# EAGLE board mainBoard (EAGLE 7.1.0)
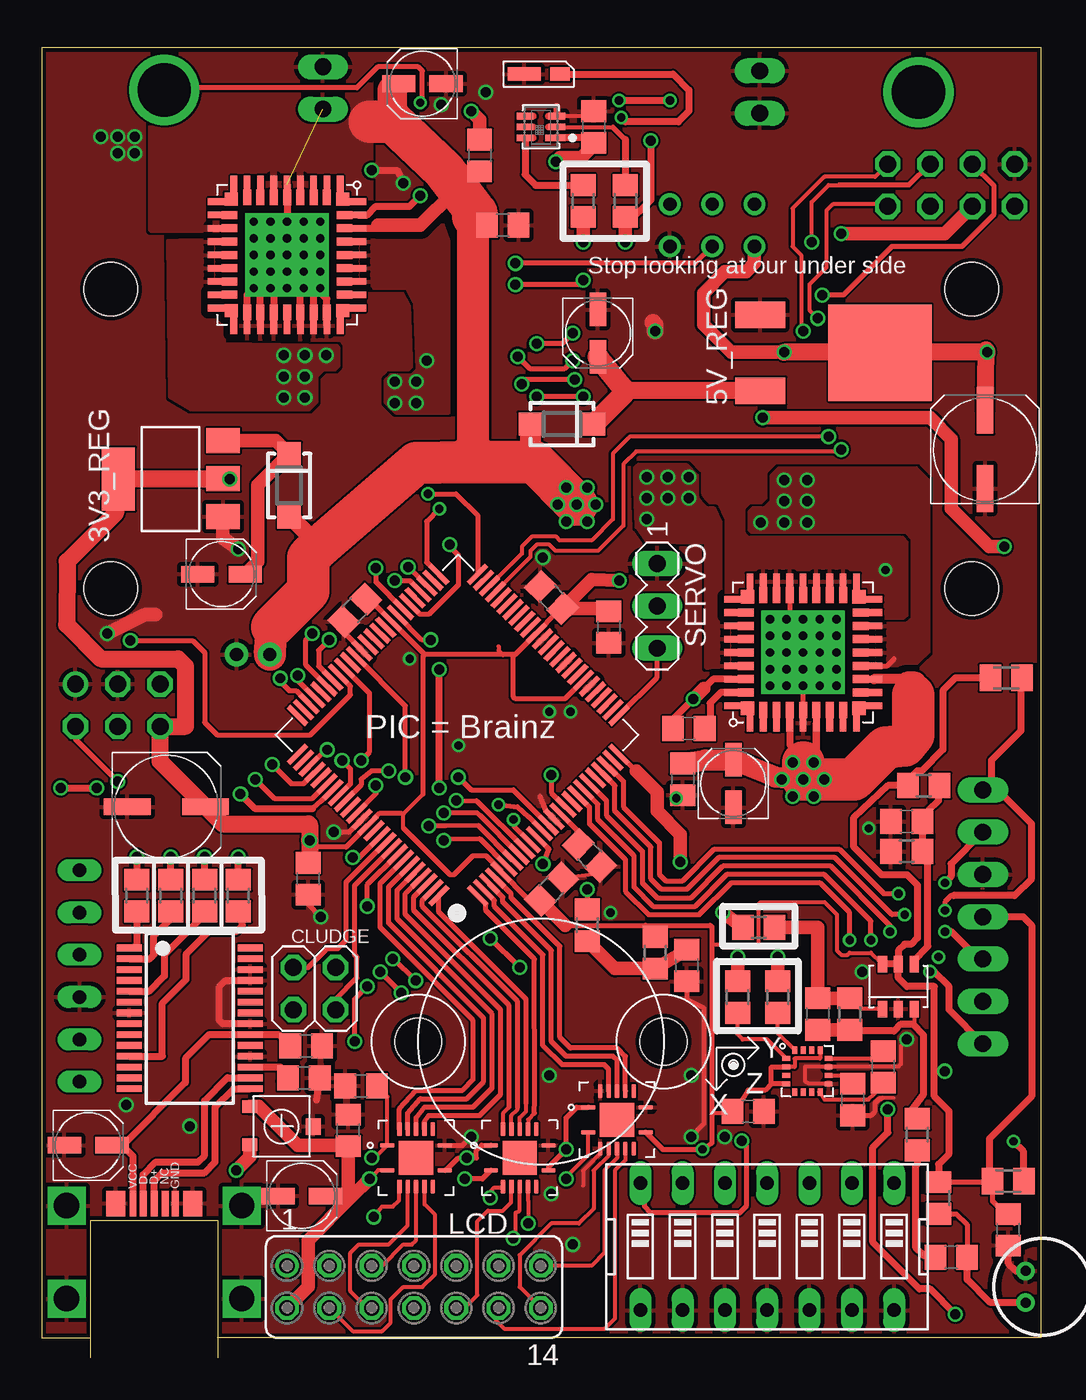
[diagram p8: board, top side]
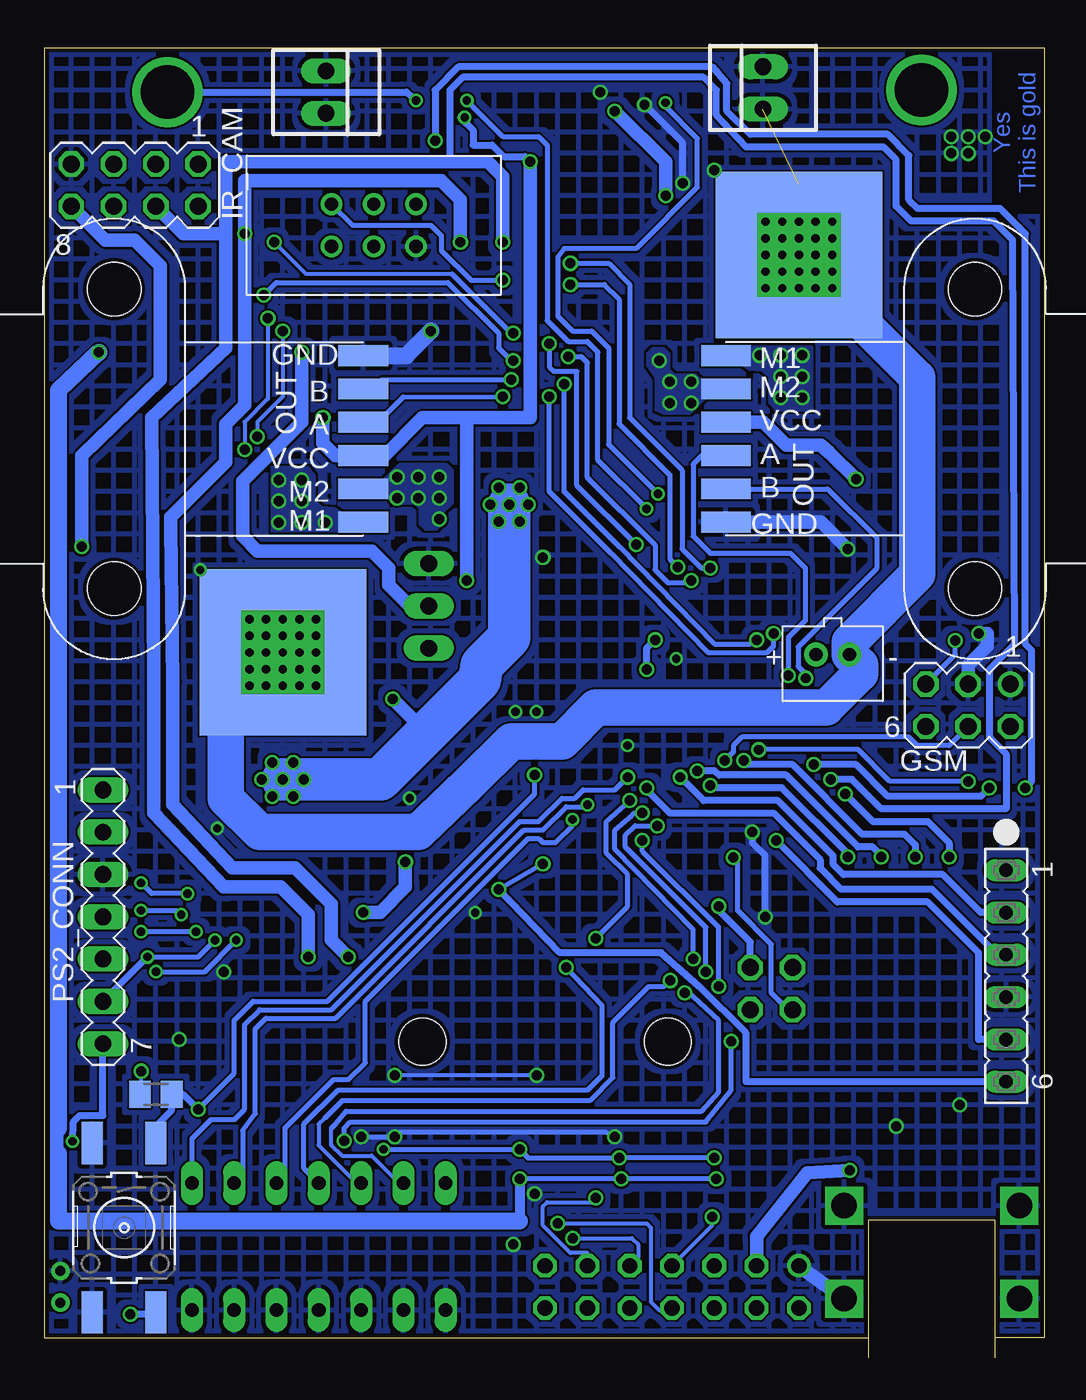
[diagram p9: board, bottom side, seen from below]

Size 60.01 x 78.69 mm. Coordinates in mm from the lower left corner, seen from the top.
Outline: 2.92,1.22 0,1.22 0,78.69 60.01,78.69 60.01,1.22 10.54,1.22
Copper layers (1*16): Top 0.035mm / dielectric 1.5mm / Bottom 0.035mm
Design rules "dirt_cheap_dirty_boards.v1": minimum track width 5mil, minimum drill 12mil, track to track 5mil, track to pad 5mil, pad to pad 5mil, via to via 5mil, smd to smd 0mil, copper to edge 10mil, drill to drill 10mil, minimum pad ring 10mil, minimum via ring 6mil, stop-mask expansion 2mil, vias tented up to drill 25mil, thermal gap 10mil

## Footprints (pad centres in the part's own frame; a part is rotated, then mirrored left to right if it is on the bottom)
SOT223 = smd 1.499 x 2.007: 1 -2.261,-3.15; 2 0.025,-3.15; 3 2.311,-3.15 | smd 3.81 x 2.007: 4 0,3.15
DPAK-2 = smd 3 x 1.6: 1 -1.5,0.8; 3 -1.5,5.37 | smd 6.2 x 5.8: 2 -8.68,3.085
UD-4X5,8_NICHICON = smd 2 x 1: + 1.425,0; - -1.425,0
JST-PH-2-THM = drill 0.8 pad 1.422: 1 1,0; 2 -1,0
UD-6,3X5,8_NICHICON = smd 2.8 x 1: + 2.35,0; - -2.35,0
C0805 = smd 1.3 x 1.5: 1 -0.95,0; 2 0.95,0
2X02 = drill 1.016 octagon: 1 -1.27,-1.27; 2 -1.27,1.27; 3 1.27,-1.27; 4 1.27,1.27
SOD123 = smd 1.4 x 1.4: A 1.9,0; C -1.9,0
MA03-2 = drill 1.016: 1 -2.54,-1.27 | drill 1.016 octagon: 2 -2.54,1.27; 3 0,-1.27; 4 0,1.27; 5 2.54,-1.27; 6 2.54,1.27
SSOP28 = smd 0.4 x 1.5: 1 -4.225,-3.625; 2 -3.575,-3.625; 3 -2.925,-3.625; 4 -2.275,-3.625; 5 -1.625,-3.625; 6 -0.975,-3.625; 7 -0.325,-3.625; 8 0.325,-3.625; 9 0.975,-3.625; 10 1.625,-3.625; 11 2.275,-3.625; 12 2.925,-3.625; 13 3.575,-3.625; 14 4.225,-3.625; 15 4.225,3.625; 16 3.575,3.625; 17 2.925,3.625; 18 2.275,3.625; 19 1.625,3.625; 20 0.975,3.625; 21 0.325,3.625; 22 -0.325,3.625; 23 -0.975,3.625; 24 -1.625,3.625; 25 -2.275,3.625; 26 -2.925,3.625; 27 -3.575,3.625; 28 -4.225,3.625
MA04-2 = drill 1.016 octagon: 1 -3.81,-1.27; 2 -3.81,1.27; 3 -1.27,-1.27; 4 -1.27,1.27; 5 1.27,-1.27; 6 1.27,1.27; 7 3.81,-1.27; 8 3.81,1.27
FE07-2 = drill 0.914: 1 -7.62,1.27 | drill 0.914 octagon: 2 -7.62,-1.27; 3 -5.08,1.27; 4 -5.08,-1.27; 5 -2.54,1.27; 6 -2.54,-1.27; 7 0,1.27; 8 0,-1.27; 9 2.54,1.27; 10 2.54,-1.27; 11 5.08,1.27; 12 5.08,-1.27; 13 7.62,1.27; 14 7.62,-1.27
WM-63PR = drill 0.6 pad 1: 1 -1,0.95; 2 -1,-0.95
MA07-1 = drill 1.016 long: 1 -7.62,0; 2 -5.08,0; 3 -2.54,0; 4 0,0; 5 2.54,0; 6 5.08,0; 7 7.62,0
R0805 = smd 1.3 x 1.5: 1 -0.95,0; 2 0.95,0
M0805 = smd 1.3 x 1.6: 1 -0.95,0; 2 0.95,0
B3F-10XX = smd 2.54 x 1.27: 1 -5.08,1.905; 2 5.08,1.905; 3 -5.08,-1.905; 4 5.08,-1.905
MA03-1 = drill 1.016 long: 1 -2.54,0; 2 0,0; 3 2.54,0
FE06 = drill 0.813 long: 1 -6.35,0; 2 -3.81,0; 3 -1.27,0; 4 1.27,0; 5 3.81,0; 6 6.35,0
EDG-07 = drill 0.813 long: 1 -7.62,-3.81; 2 -5.08,-3.81; 3 -2.54,-3.81; 4 0,-3.81; 5 2.54,-3.81; 6 5.08,-3.81; 7 7.62,-3.81; 8 7.62,3.81; 9 5.08,3.81; 10 2.54,3.81; 11 0,3.81; 12 -2.54,3.81; 13 -5.08,3.81; 14 -7.62,3.81
TCS3472_FN6 = smd 1.2 x 0.4: P$1 -0.85,0.65 | smd 1 x 0.4: P$2 -0.95,0; P$3 -0.95,-0.65; P$4 0.95,-0.65; P$5 0.95,0; P$6 0.95,0.65
QTFP-100 = smd 1.524 x 0.305: P1 -0.1,13.55; P2 -0.1,13.05; P3 -0.1,12.55; P4 -0.1,12.05; P5 -0.1,11.55; P6 -0.1,11.05; P7 -0.1,10.55; P8 -0.1,10.05; P9 -0.1,9.55; P10 -0.1,9.05; P11 -0.1,8.55; P12 -0.1,8.05; P13 -0.1,7.55; P14 -0.1,7.05; P15 -0.1,6.55; P16 -0.1,6.05; P17 -0.1,5.55; P18 -0.1,5.05; P19 -0.1,4.55; P20 -0.1,4.05; P21 -0.1,3.55; P22 -0.1,3.05; P23 -0.1,2.55; P24 -0.1,2.05; P25 -0.1,1.549; P51 15.2,1.549; P52 15.2,2.05; P53 15.2,2.55; P54 15.2,3.05; P55 15.2,3.55; P56 15.2,4.05; P57 15.2,4.55; P58 15.2,5.05; P59 15.2,5.55; P60 15.2,6.05; P61 15.2,6.55; P62 15.2,7.05; P63 15.2,7.55; P64 15.2,8.05; P65 15.2,8.55; P66 15.2,9.05; P67 15.2,9.55; P68 15.2,10.05; P69 15.2,10.55; P70 15.2,11.05; P71 15.2,11.55; P72 15.2,12.05; P73 15.2,12.55; P74 15.2,13.05; P75 15.2,13.55 | smd 0.305 x 1.524: P26 1.549,-0.1; P27 2.05,-0.1; P28 2.55,-0.1; P29 3.05,-0.1; P30 3.55,-0.1; P31 4.05,-0.1; P32 4.55,-0.1; P33 5.05,-0.1; P34 5.55,-0.1; P35 6.05,-0.1; P36 6.55,-0.1; P38 7.55,-0.1; P39 8.05,-0.1; P40 8.55,-0.1; P41 9.05,-0.1; P42 9.55,-0.1; P43 10.05,-0.1; P44 10.55,-0.1; P45 11.05,-0.1; P46 11.55,-0.1; P47 12.05,-0.1; P48 12.55,-0.1; P49 13.05,-0.1; P50 13.55,-0.1; P76 13.55,15.2; P77 13.05,15.2; P78 12.55,15.2; P79 12.05,15.2; P80 11.55,15.2; P81 11.05,15.2; P82 10.55,15.2; P83 10.05,15.2; P84 9.55,15.2; P85 9.05,15.2; P86 8.55,15.2; P87 8.05,15.2; P88 7.55,15.2; P89 7.05,15.2; P90 6.55,15.2; P91 6.05,15.2; P92 5.55,15.2; P93 5.05,15.2; P94 4.55,15.2; P95 4.05,15.2; P96 3.55,15.2; P97 3.05,15.2; P98 2.55,15.2; P99 2.05,15.2; P100 1.549,15.2; P337 7.05,-0.1
MICRO_USB_FCI = smd 0.406 x 1.524: D+ 0,2.921; D- -0.66,2.921; GND 1.27,2.921; ID 0.66,2.921; VCC -1.27,2.921 | smd 1.143 x 1.524: GND1 -2.311,2.921; GND2 2.311,2.921 | drill 1.524 square: P$1 -5.258,2.794; P$2 -5.258,-2.794; P$3 5.258,-2.794; P$4 5.258,2.794
HMC5883L = smd 0.457 x 0.305: P$1 -1.27,0.762; P$2 -1.27,0.254; P$3 -1.27,-0.254; P$4 -1.27,-0.762; P$9 1.27,-0.762; P$10 1.27,-0.254; P$11 1.27,0.254; P$12 1.27,0.762 | smd 0.305 x 0.457: P$5 -0.762,-1.27; P$6 -0.254,-1.27; P$7 0.254,-1.27; P$8 0.762,-1.27; P$13 0.762,1.27; P$14 0.254,1.27; P$15 -0.254,1.27; P$16 -0.762,1.27
OPA334 = smd 0.55 x 1: P$1 -0.95,-1.35; P$2 0,-1.35; P$3 0.95,-1.35; P$4 0.95,1.35; P$5 0,1.35; P$6 -0.95,1.35
LED = smd 1.2 x 0.8: ANODE -1.15,0 | smd 2 x 0.8: CATHODE 1,0
PVG3G-SMT-TRIMMER = smd 0.75 x 0.9: P$1 0.6,-0.2; P$2 2.9,-0.2 | smd 1 x 0.9: P$3 1.8,3.6
CASTER = hole 2.8: -7.366,0; 7.366,0
MOTOR = smd 3 x 1.25: GND 28,5; M1 28,-5; M2 28,-3; OUTA 28,1; OUTB 28,3; VCC 28,-1 | hole 3.2: 13.05,9; 13.05,-9
PQFN = smd 1 x 0.4: AGND -4.25,0; FB -4.25,-2.4; IN1 -4.25,2.4; IN2 -4.25,3.2; INV -4.25,-1.6; P$58 -4.25,-3.2; P$64 4.25,-3.2; P$65 4.25,-3.2; P$68 4.25,3.2; P$75 -4.25,3.2; PGND_1 4.25,-2.4; PGND_2 4.25,-1.6; PGND_3 4.25,-0.8; PGND_4 4.25,0.8; PGND_5 4.25,1.6; PGND_6 4.25,2.4; SF 4.25,0; SLEW -4.25,1.6; VPWR -4.25,0.8; VPWR1 -4.25,-0.8 | smd 5 x 5: AGND_L 0,0 | smd 0.4 x 1: CCP -2.4,4.25; D1 2.4,4.25; D2 2.4,-4.25; EN -2.4,-4.25; OUT1_1 -0.8,-4.25; OUT1_2 0,-4.25; OUT1_3 0.8,-4.25; OUT1_4 1.6,-4.25; OUT2_1 1.6,4.25; OUT2_2 0.8,4.25; OUT2_3 0,4.25; OUT2_4 -0.8,4.25; P$59 -3.2,-4.25; P$60 -3.2,-4.25; P$63 3.2,-4.25; P$69 3.2,4.25; P$70 3.2,4.25; P$73 -3.2,4.25; VPWR2 -1.6,-4.25; VPWR_2 -1.6,4.25 | smd 0.95 x 0.48: P$1 -3.45,-2.4; P$2 -3.45,-1.6; P$3 -3.45,-0.8; P$4 -3.45,0; P$5 -3.45,0.8; P$6 -3.45,1.6; P$7 -3.45,2.4; P$16 3.45,2.4; P$17 3.45,1.6; P$18 3.45,0.8; P$19 3.45,0; P$20 3.45,-0.8; P$21 3.45,-1.6; P$22 3.45,-2.4 | smd 0.8 x 0.8: P$8 -3.35,-3.35; P$44 3.35,3.35; P$62 3.35,-3.35; P$72 -3.35,3.35 | smd 0.48 x 0.95: P$30 2.4,-3.45; P$31 1.6,-3.45; P$32 0.8,-3.45; P$33 0,-3.45; P$34 -0.8,-3.45; P$35 -1.6,-3.45; P$36 -2.4,-3.45; P$45 -2.4,3.45; P$46 -1.6,3.45; P$47 -0.8,3.45; P$48 0,3.45; P$49 0.8,3.45; P$50 1.6,3.45; P$51 2.4,3.45 | smd 0.78 x 0.78: P$61 -3.35,-3.35; P$66 3.35,-3.35; P$71 3.35,3.35; P$76 -3.35,3.35 | drill 0.5 square: P$77 -2,2; P$80 -1,2; P$81 0,2; P$82 1,2; P$83 2,2; P$84 2,1; P$85 1,1; P$86 0,1; P$87 -1,1; P$88 -2,1; P$89 -2,0; P$90 -1,0; P$91 0,0; P$92 1,0; P$93 2,0; P$94 2,-1; P$95 1,-1; P$96 0,-1; P$97 -1,-1; P$98 -2,-1; P$99 -2,-2; P$100 -1,-2; P$101 0,-2; P$102 1,-2; P$103 2,-2 | smd 10 x 10 bottom: P$78 0,0
S-PVQFN-N14 = smd 0.85 x 0.28: 1 -1.725,0.75; 7 1.725,0.75; 8 1.725,-0.75; 14 -1.725,-0.75 | smd 0.28 x 0.85: 2 -1,1.725; 3 -0.5,1.725; 4 0,1.725; 5 0.5,1.725; 6 1,1.725; 9 1,-1.725; 10 0.5,-1.725; 11 0,-1.725; 12 -0.5,-1.725; 13 -1,-1.725 | smd 2.05 x 2.05: AGND 0,0
PIXY_HEADER = drill 0.8: 1 -2.54,1.27; 2 -2.54,-1.27; 3 0,1.27; 4 0,-1.27; 5 2.54,1.27; 6 2.54,-1.27
22-23-2021 = drill 1 long: 1 -1.27,0; 2 1.27,0

## Placement (x,y rotation side)
3V3_REG  REG1117  [SOT223]  7.75,52.78 90 top
5V_REG  NCP1117-DPAK  [DPAK-2]  41.66,63.45 180 top
10UF  10uF  [UD-4X5,8_NICHICON]  15.62,9.73 0 top
BATT_CON  [JST-PH-2-THM]  12.7,42.24 180 bottom
C1  10uF  [UD-4X5,8_NICHICON]  33.4,61.54 270 top
C2  10uF  [UD-4X5,8_NICHICON]  10.79,47.07 0 top
C3  100uF  [UD-6,3X5,8_NICHICON]  56.64,54.56 90 top
C4  100uF  [UD-6,3X5,8_NICHICON]  7.49,33.1 0 top
C5  0.1uF  [C0805]  15.75,16.81 0 top
C6  10uF  [UD-4X5,8_NICHICON]  2.79,12.78 0 top
C7  0.1uF  [C0805]  15.88,18.75 0 top
C8  .22uF  [C0805]  50.52,17.48 90 top
C9  4.7uF  [C0805]  48.69,15.52 270 top
C10  0.1uF  [C0805]  42.42,14.81 0 top
C11  1uF  [C0805]  51.94,32.21 180 top
C12  4.7uF  [C0805]  54.61,6.05 180 top
C13  12pF  [C0805]  46.61,20.65 90 top
C14  0.1uF  [C0805]  58.04,7.7 270 top
C15  0.1uF  [C0805]  33.15,73.93 90 top
C16  0.1uF  [C0805]  16,28.78 270 top
C17  0.1uF  [C0805]  19.18,16.33 180 top
C18  0.1uF  [C0805]  30.61,28.14 45 top
C19  0.1uF  [C0805]  30.61,45.67 135 top
C20  0.1uF  [C0805]  18.8,44.91 225 top
C21  0.1uF  [C0805]  18.41,13.67 90 top
C22  33nF  [C0805]  38.86,37.8 0 top
C23  0.1uF  [C0805]  38.48,34.75 270 top
C24  100uF  [UD-4X5,8_NICHICON]  41.53,34.49 90 top
C25  33nF  [C0805]  26.29,72.21 90 top
C26  0.1uF  [C0805]  27.69,68.02 0 top
C27  100uF  [UD-4X5,8_NICHICON]  22.86,76.53 180 top
C28  0.1uF  [C0805]  34.04,43.89 270 top
C29  0.1uF  [C0805]  32.89,30.18 315 top
C30  0.1uF  [C0805]  38.73,23.57 270 top
CLUDGE  [2X02]  16.38,22.17 180 top
D1  [SOD123]  14.86,52.4 270 top
D2  [SOD123]  31.24,56.08 180 top
GSM  [MA03-2]  4.57,39.19 180 bottom
IC1  FT232RL  [SSOP28]  8.89,20.4 270 top
IR_CAM  [MA04-2]  54.61,70.43 180 bottom
LCD  [FE07-2]  22.35,4.27 0 top
M1  ELECTRET_MICROPHON-WM-63PR  [WM-63PR]  60.07,4.27 0 top
PS2_CONN  [MA07-1]  56.52,26.49 270 bottom
R1  10K  [R0805]  52.58,13.41 90 top
R2  1M  [R0805]  48.51,20.65 90 top
R4  2.2K  [R0805]  53.85,9.6 90 top
R5  10K  [R0805]  52.96,34.37 180 top
R6  10K  [R0805]  51.94,30.43 0 top
R7  0  [R0805]  43.05,25.86 0 top
R8  0  [R0805]  41.78,21.67 90 top
R9  0  [R0805]  44.2,21.67 90 top
R10  0  [R0805]  5.71,27.76 90 top
R11  0  [R0805]  9.78,27.76 90 top
R12  0  [R0805]  11.81,27.76 90 top
R13  0  [R0805]  7.75,27.76 90 top
R14  0  [R0805]  32.51,69.48 270 top
R15  0  [R0805]  35.05,69.48 270 top
R16  100  [R0805]  32.77,25.98 90 top
R17  10k  [R0805]  36.83,24.33 90 top
R18  4.7K  [M0805]  53.34,15.82 180 bottom
R19  4.7K  [M0805]  57.91,40.84 180 top
R20  4.7K  [M0805]  58.04,10.62 180 top
S1  [B3F-10XX]  55.24,7.82 270 bottom
SERVO  [MA03-1]  36.96,45.16 270 top
SV1  [FE06]  2.29,22.94 270 bottom
SW1  [EDG-07]  43.56,6.68 180 top
U1  TCS34725  [TCS3472_FN6]  29.97,73.93 180 top
U$1  PIC18F97J94  [QTFP-100]  35.69,37.41 135 top
U$2  MICRO_USB  [MICRO_USB_FCI]  6.76,6.35 0 top
U$3  HMC5883L  [HMC5883L]  45.97,17.22 0 top
U$4  OPA334  [OPA334]  51.44,22.3 0 top
U$5  LED  [LED]  29.97,77.1 180 top
U$6  PVG3G-SMD-TRIMMER  [PVG3G-SMT-TRIMMER]  12.7,15.7 270 top
U$7  POLOLU_BALLCASTER  [CASTER]  29.97,19 0 top
U$8  POLOLU_MOTORDRIVE  [MOTOR]  68.9,55.19 0 bottom
U$9  POLOLU_MOTORDRIVE  [MOTOR]  -8.89,55.19 180 bottom
U$10  MOTORDRIVE  [PQFN]  45.72,42.37 90 top
U$11  MOTORDRIVE  [PQFN]  14.73,66.24 270 top
U$12  TXB0104  [S-PVQFN-N14]  22.48,12.01 0 top
U$13  TXB0104  [S-PVQFN-N14]  28.7,12.01 0 top
U$14  TXB0104  [S-PVQFN-N14]  34.54,14.3 0 top
U$15  PIXY  [PIXY_HEADER]  40.26,68.02 0 bottom
X1  22-23-2021  [22-23-2021]  16.89,76.28 90 bottom
X2  22-23-2021  [22-23-2021]  43.12,76.02 270 bottom

## Tracks (layer width: path | path; a pad name or v marks a point on that pad's centre or on a via)
+3V3  (via drill 0.5, 0.6)
  Top 0.254: 32.85,73.28 C15.1 | U$3.P$13 46.74,17.98 45.21,17.98 45.21,17.48 U$3.P$2 | v19.81,12.01 20,12.01 U$12.1 20.75,15.71 C17.1 | 30.75,11.26 U$13.8 | U$4.P$6 50.47,23.65 49.78,24.33 48.51,24.33 48.39,24.21 48.01,24.21 47.75,24.46 47.75,26.62 46.99,27.38 43.18,27.38 43.05,27.25 43.05,24.84 40.26,24.84 40.26,24.59 | 21.72,31.83 21.72,32.67 | 21.72,32.67 22.91,33.86 | 21.59,32.72 21.67,32.72 21.72,32.67 | 27.43,42.75 27.43,42.49 27.69,42.24 | C10.1 41.34,14.68 40.26,14.68 | v54.23,17.22 53.59,17.22 53.59,17.35
  Top 0.305: v25.53,12.01 25.97,12.01 | v25.53,12.01 26.1,12.01 26.1,12.46 26.42,12.78 26.96,12.78 U$13.1 | 28.32,42.24 28.42,42.24 U$1.P40 31,44.82 C19.1 31.46,44.82 | 28.32,42.24 27.69,42.24 23.01,42.24 | 23.01,42.24 U$1.P59 19.67,45.58 C20.1 | 21.72,31.83 24.51,29.03 24.77,29.03 25.91,30.18 26.67,30.18 27.59,29.25 U$1.P5 29.17,27.6 C18.1 | 22.91,33.86 22.91,42.14 23.01,42.24 | 28.32,42.24 28.32,39.7 28.45,39.57 31.41,39.57 U$1.P32 | 31.42,25.98 36.26,25.98 | 36.26,25.98 40.13,25.98 40.26,25.86 40.26,24.59 40.26,14.68 40.26,12.9 v39.67,12.52 37.3,12.52 U$14.8 | R17.2 36.26,25.98 | U$3.P$2 43.81,17.48 43.81,16.46 | U$3.P$4 43.81,16.46 | 43.81,16.46 43.43,16.08 42.42,16.08 41.66,14.87 C10.1 | 21.59,32.72 20.31,32.72 U$1.P88 18.28,30.68 16.09,30.68 v16.09,31.08 | U$12.8 24.27,11.26 25.02,12.01 v25.53,12.01 | U$14.1 32.12,15.05 31.5,14.43 v31.5,12.52 30.43,11.45 U$13.8 | C14.1 58.42,8.08 57.09,9.41 R20.2 | 56.9,13.16 56.9,10.62 56.83,10.55 R4.2
  Top 0.406: 32.85,73.28 U1.P$1 | U$4.P$5 U$4.P$6 | U$4.P$5 51.44,22.81 51.94,22.3 53.59,22.3 53.59,17.35 53.59,15.7 54.48,14.81 54.48,12.27 53.85,11.63 R4.2 53.91,10.49 | U$4.P$5 51.44,24.46 51.82,24.84 52.2,24.84 52.58,25.22 52.58,28.4 51.94,29.03 50.42,29.03 48.77,30.68 48.77,32.46 50.8,34.37 R5.2 52.2,34.55 52.2,34.87 52.58,35.26 52.83,35.26 54.1,36.53 54.1,40.08 54.86,40.84 R19.2 | R20.2 56.9,10.81 56.9,13.16 59.44,15.7 59.44,25.98 58.93,26.49 PS2_CONN.4 | U$5.ANODE 37.91,77.1 38.86,76.15 38.86,74.88 38.23,74.24 35.05,74.24 v34.8,74.5
  Top 0.813: C15.1 33.15,72.85 32.38,72.09 31.11,72.09 v30.86,71.83 | v11.3,52.78 11,52.78 3V3_REG.2 | C18.1 31.42,25.98 | 33.88,45 33.4,45 | 33.4,45 C19.1 33.02,46.74 v34.67,46.69 | C28.1 33.56,44.84 33.4,45 | v43.31,56.46 53.34,56.46 54.61,55.19 54.61,51 56.9,48.72 v57.78,48.72
  Top 1.016: C16.1 16.09,29.82 v16.09,31.08 16.09,32.02 16.03,32.08 10.86,32.08 C4.+ 7.11,35.83 GSM.6 8.64,37.92 8.64,41.54 8.19,41.99 3.56,41.99 1.5,44.04 1.52,47.83 4.45,50.75 4.45,52.78 v11.3,52.78 9.65,52.78
  Top 1.422: 3V3_REG.2 10.87,52.78
  Bottom 0.254: R18.2 54.23,15.82 v54.23,17.22
  Bottom 0.305: v19.81,12.01 v25.53,12.01 30.99,12.01 v31.5,12.52 v39.67,12.52
  Bottom 0.406: SV1.5 3.94,19.13 3.94,24.33 6.99,27.38 12.42,27.38 v16.09,31.08 | 30.73,71.96 v30.86,71.83 31.18,72.15 32.45,72.15 33.15,72.85 34.29,72.85 34.29,73.74 35.05,74.5 v34.8,74.5
  Bottom 0.813: U$9.VCC 16.88,56.19 15.49,54.81 13.41,54.81 12.9,54.38 v11.3,52.78 | 34.67,56.46 37.34,56.46 39.61,54.19 U$8.VCC 42.56,54.19 43.31,54.94 v43.31,56.46 | 34.67,56.46 30.86,56.46 v30.86,71.83 | IR_CAM.8 56.39,67.13 54.61,67.13 53.09,65.61 53.09,58.75 57.78,54.18 v57.78,48.72 | v34.67,46.69 34.67,56.46
+5V  (via drill 0.6)
  Top 0.254: U$12.14 20.2,11.26 v19.68,10.74 | v31.5,10.74 31.5,10.87 32.82,12.19 U$14.14
  Top 0.305: v25.4,10.74 26.46,10.74 U$13.14
  Top 0.406: 5V_REG.2 51.18,60.36 51.18,60.4
  Top 0.813: v19.68,10.74 18.54,9.6 | 18.6,12.84 C21.1 | C21.1 18.32,12.77 15.49,12.78 15.37,12.78 13.05,15.1 U$6.P$1 | 14.76,3 LCD.2 16,4.27 16,7.06 18.54,9.6 | 10UF.+ 18.54,9.73 18.54,9.6 | 18.54,9.6 18.41,9.73 C21.1 | v44.58,60.4 41.4,60.4 39.75,62.05 39.75,63.96 41.02,65.23 42.29,65.23 42.8,65.74 U$15.2
  Top 1.016: C3.+ 56.71,60.53 v56.77,60.4 51.18,60.4 v44.58,60.4
  Bottom 0.305: v19.68,10.74 v25.4,10.74 v31.5,10.74
  Bottom 0.61: v31.5,10.74 31.5,8.2
  Bottom 0.813: SERVO.2 38.1,45.16 39.37,46.43 39.37,47.45 40.39,48.46 47.24,48.46 48.13,49.35 48.13,52.65 44.58,56.21 v44.58,60.4 | 59.18,12.27 59.28,12.37 59.28,13.67 59.18,13.64 59.18,13.79
  Bottom 1.016: 31.5,8.2 59.18,8.2 59.18,12.27 | v56.77,60.4 59.18,58.12 59.18,13.79
ACK  (via drill 0.5)
  Top 0.305: v48.51,25.1 48.51,26.75 46.74,28.52 41.4,28.52 39.5,26.62 36.45,26.62 35.05,28.02 35.05,29.92 32.89,32.08 32.89,33.07 U$1.P18
  Top 0.406: v58.34,13.01 58.93,12.42 58.93,10.68 R20.1 | v53.34,23.19 53.59,23.19 54.48,22.3 54.48,20.9 PS2_CONN.7
  Bottom 0.305: v53.34,23.19 50.42,23.19 v48.51,25.1
  Bottom 0.406: PS2_CONN.7 56.52,14.55 57.91,14.55 58.29,14.17 v58.34,13.01
ATT  (via drill 0.5)
  Top 0.305: v50.93,25.6 50.93,25.98 47.37,29.54 40.89,29.54 38.99,27.64 36.96,27.64 36.07,28.52 36.07,30.43 33.91,32.59 33.91,33.46 U$1.P20
  Top 0.406: v54.23,25.6 54.61,25.6 56.26,23.95 PS2_CONN.5
  Bottom 0.305: v54.23,25.6 v50.93,25.6
BUTTON  (via drill 0.6)
  Top 0.305: v30.61,35 30.61,33.94 U$1.P16
  Top 0.406: v54.86,2.62 53.34,4.14 52.7,4.14 49.91,6.93 49.91,12.65 50.8,13.54 v50.8,14.94
  Bottom 0.305: v50.8,14.94 48.64,17.09 48.64,20.27 47.5,21.41 43.05,21.41 30.61,33.86 v30.61,35
  Bottom 0.406: S1.2 53.47,2.62 v54.86,2.62 | v50.8,14.94 51.69,15.82 R18.1 52.39,14.87 53.34,13.92 S1.1
CLK  (via drill 0.5)
  Top 0.305: v49.78,25.1 49.78,26.24 46.99,29.03 41.15,29.03 39.24,27.13 36.7,27.13 35.56,28.27 35.56,30.18 33.4,32.33 33.4,33.27 U$1.P19
  Bottom 0.305: v53.85,24.08 50.8,24.08 v49.78,25.1
  Bottom 0.406: v53.85,24.08 PS2_CONN.6
CLUDGE_0  (via drill 0.6)
  Top 0.305: v19.56,27.13 19.56,28.43 U$1.P93
  Bottom 0.406: CLUDGE.1 17.65,24.97 19.56,26.87 v19.56,27.13
CLUDGE_1
  Top 0.305: CLUDGE.2 17.65,21.54 18.92,22.81 18.92,24.08 18.8,24.21 18.8,28.37 U$1.P92
CLUDGE_2
  Top 0.305: CLUDGE.3 16,23.44 17.14,24.59 17.78,24.59 18.29,25.1 18.29,28.57 U$1.P91
CLUDGE_3  (via drill 0.6)
  Top 0.305: v18.67,30.05 19.06,30.05 U$1.P90
  Bottom 0.305: CLUDGE.4 15.37,20.9 16.38,21.92 16.38,24.84 18.41,26.87 18.41,29.79 v18.67,30.05
CMD  (via drill 0.5)
  Top 0.305: U$1.P23 34.01,35.54 34.92,34.62 34.92,33.1 37.08,30.94 37.08,29.03 37.47,28.65 38.48,28.65 40.39,30.56 47.88,30.56 50.55,27.89 v51.44,27.89
  Top 0.406: v54.23,28.52 54.61,28.91 54.61,29.67 PS2_CONN.2
  Bottom 0.305: v51.44,27.89 53.59,27.89 v54.23,28.52
DAT  (via drill 0.5)
  Top 0.305: 54.74,27.76 54.61,27.76 54.23,27.38 v54.23,26.87 | v51.82,26.62 51.05,26.62 47.62,30.05 40.64,30.05 38.73,28.14 37.21,28.14 36.58,28.78 36.58,30.68 34.42,32.84 34.42,34.37 U$1.P22
  Top 0.406: R19.1 58.8,40.78 58.8,37.67 57.02,35.89 57.02,34.11 | 54.74,27.76 58.42,27.76 59.44,28.78 59.44,32.08 57.4,34.11 57.02,34.11 | 57.02,34.11 PS2_CONN.1
  Bottom 0.305: v54.23,26.87 52.07,26.87 v51.82,26.62
GND  (via drill 0.5, 0.6)  (1 unrouted)
  Top 0.203: 50.47,15.62 51.16,15.62
  Top 0.254: U$3.P$9 46.1,16.46 45.85,16.59 45.85,17.5 51.44,17.5 51.59,17.65 51.59,18.72 v51.94,19.13 | C15.2 32.85,74.58 U1.P$3 | C18.2 33.13,29.07 C29.2 | U$14.13 33.54,12.28 32.51,11.25 32.51,10.36 | 50.42,15.57 50.47,15.62
  Top 0.305: U$12.7 25.26,12.76 v25.78,13.28 | C30.2 38.73,21.54 39.75,21.03 39.75,14.05 v38.99,13.28 | U$1.P64 18.12,43.59 C20.2 | U$10.AGND U$10.AGND_L 44.92,43.17 U$10.PGND_4 | U$1.P14 30.25,32.89 29.92,33.73 | v17.53,31.57 18.46,31.57 U$1.P87 | v16.76,26.49 16,27.25 C16.2 | C9.2 49.8,14.57 50.04,14.81 50.04,15.32 50.29,15.57 50.42,15.57
  Top 0.406: 30.92,75.15 U1.P$3 | U$11.PGND_4 15.53,64.08 | 15.53,64.08 15.53,67.22 U$11.AGND_L | 16.51,15.48 C5.2 | U$11.AGND_L 14.73,65.86 13.93,65.06 13.93,64.08 | 13.93,64.08 U$11.PGND_3 | U$11.PGND_1 12.33,63.84 12.57,64.08 13.21,64.08 | 13.21,64.08 13.93,64.08 | U$11.PGND_2 13.13,64.01 13.21,64.08 | U$11.PGND_6 17.13,63.59 16.64,64.08 16.38,64.08 | 16.38,64.08 16.26,64.08 | 16.26,64.08 15.53,64.08 | U$11.PGND_5 16.33,64.01 16.26,64.08 | 13.97,67.51 13.97,66.37 14.86,66.37 14.86,65.61 16.38,64.08 | U$11.AGND U$11.AGND_L | v19.81,71.32 21.34,71.32 v21.72,70.56 | IC1.21 10.87,20.07 10.67,20.27 10.67,22.3 11.04,22.67 IC1.25 | M1.1 58.49,5.22 58.04,5.66 C14.2
  Top 0.813: 3V3_REG.1 10.87,49.23 v11.81,48.59 | v3.94,43.51 6.22,44.65 6.86,44.65
  Top 1.016: v36.83,61.67 36.83,62.05 36.7,62.18
  Bottom 0.254: v30.48,16.97 v38.99,16.97 | v31.88,6.81 31.75,6.81
  Bottom 0.305: v41.02,13.28 v38.99,13.28 38.73,13.54 26.29,13.54 v25.78,13.28
  Bottom 0.406: v16.76,26.49 16.76,30.18 17.53,30.94 v17.53,31.57 | v21.72,70.56 21.72,72.97 v24,75.26
  Bottom 0.813: LCD.1 14.58,5.41 U$2.P$3 | v11.81,48.59 13.38,50.19 U$9.GND | GSM.3 4.57,41.61 3.43,42.75 3.43,43.51 v3.94,43.51
  Bottom 1.016: U$8.GND 38.31,60.19 v36.83,61.67
  other vias: 30.1,48.08 49.28,23.19 5.08,15.19 8.89,13.92 26.67,76.02 3.56,73.36 4.57,73.36 5.59,73.36 4.57,72.34 5.59,72.34 30.48,38.81 31.75,38.81 25.02,36.78 22.1,41.99 49.66,31.8 34.16,26.75 38.1,33.6 30.61,9.86 50.67,47.32
  pour Top (isolate 0.127, rank 2): -0.13,79.2 -0.38,0.71 60.2,0.46 60.45,78.94
  pour Bottom (isolate 0.127, rank 6, hatched): 0,78.82 -0.13,1.09 2.92,1.09 2.92,8.08 10.29,8.08 10.41,1.22 60.2,1.35 59.94,79.07
GSM_RST  (via drill 0.6)
  Top 0.305: U$1.P68 18.54,40.35 18.54,39.83 16.13,37.41 10.54,37.41 9.78,38.18 9.78,42.37 9.07,43.08 v5.33,43.08
  Bottom 0.305: GSM.5 5.33,42.24 v5.33,43.08
GSM_RX  (via drill 0.6)
  Top 0.305: v19.18,35.89 19.68,36.4 19.68,39.91 U$1.P67
  Bottom 0.305: v19.18,35.89 18.67,36.4 18.67,36.78 18.16,37.29 8.13,37.29 7.62,36.78 5.71,36.78 GSM.4
GSM_TX  (via drill 0.6)
  Top 0.305: GSM.2 2.03,37.16 v4.57,34.62 | v17.14,36.53 17.02,36.49 U$1.P78
  Bottom 0.305: v4.57,34.62 9.27,34.62 11.18,36.53 v17.14,36.53
I2C_SCL  (via drill 0.6)
  Top 0.305: v13.84,35.64 14.99,34.49 15.72,34.49 U$1.P79
  Top 0.406: v36.58,73.1 36.58,69.55 35.05,68.02 | v1.14,34.24 v3.3,34.24
  Top 0.813: R8.2 v41.78,24.08 | v35.05,67.01 35.05,68.02 R15.2 | IR_CAM.6 54.23,67.51 v48.01,67.51
  Bottom 0.406: v36.58,73.1 36.58,76.15 35.18,77.55 19.94,77.55 19.05,76.53 19.05,74.88 17.65,73.48 9.4,73.48 8.13,72.21 8.13,69.55 7.62,69.04 2.67,69.04 1.14,67.51 1.14,42.88 0.76,42.49 0.76,34.62 v1.14,34.24 | v3.3,34.24 3.81,33.73 9.4,33.73 11.3,35.64 v13.84,35.64
  Bottom 0.813: v35.05,67.01 35.05,69.55 36.19,70.69 48.01,70.69 v48.01,67.51 48.01,57.23 49.15,56.08 49.15,53.8 52.45,50.5 52.45,49.86 52.32,40.59 52.32,33.22 48.77,29.41 44.96,29.41 42.8,27.25 42.8,25.1 v41.78,24.08
I2C_SCL1  (via drill 0.6)
  Top 0.305: IR_CAM.5 57.15,70.43 57.15,68.66 55.24,66.75 51.05,66.75 48.13,63.83 v46.86,63.83 | v31.88,59.89 31.37,59.39 29.34,59.39 v28.57,60.15 | v21.21,46.69 22.1,46.69 U$1.P54
  Bottom 0.305: v46.86,63.83 46.1,64.59 35.81,64.59 32.77,61.54 32.77,60.66 32,59.89 v31.88,59.89 | v28.57,60.15 27.81,60.15 27.43,59.77 27.43,52.88 23.37,48.82 23.37,47.32 22.61,46.56 21.34,46.56 v21.21,46.69
I2C_SDA  (via drill 0.6)
  Top 0.305: v12.83,34.75 13.97,33.6 16.25,33.6 U$1.P81
  Top 0.813: R9.2 v44.2,24.08 | v32.51,67.01 R14.2
  Bottom 0.406: 35.69,71.83 35.69,76.15 34.92,76.91 20.45,76.91 19.68,76.15 19.68,74.63 17.91,72.72 9.65,72.72 8.89,71.96 8.89,69.16 8,68.28 3.05,68.28 1.91,67.13 1.78,42.88 3.3,41.35 3.3,37.29 2.29,36.27 2.29,32.97 9.78,32.97 11.56,34.75 v12.83,34.75
  Bottom 0.813: v32.51,67.01 32.51,70.94 33.4,71.83 35.69,71.83 49.15,71.83 49.15,67.51 | 49.15,67.51 49.15,60.66 53.59,56.46 53.47,40.97 53.47,32.72 49.28,28.27 45.85,28.27 44.2,26.62 v44.2,24.08 | IR_CAM.4 51.69,67.51 49.15,67.51
I2C_SDA1  (via drill 0.6)
  Top 0.254: 46.23,66.88 v46.23,67.01 46.23,69.42 47.24,70.43 47.88,70.43
  Top 0.305: IR_CAM.3 52.07,70.43 47.88,70.43 | v31.88,61.54 31.24,60.91 v29.72,60.91 | v24.51,48.84 24.51,48.72 25.02,48.21 25.02,46.43 23.24,44.65 22.72,44.65 U$1.P56
  Bottom 0.254: 35.56,65.1 44.32,65.1 v46.23,67.01
  Bottom 0.305: 35.56,65.1 32,61.54 v31.88,61.54 | v29.72,60.91 29.72,59.51 29.46,59.26 28.07,59.26 28.07,52.4 v24.51,48.84
L_WHISKER  (via drill 0.5, 3.2)
  Top 0.305: v23.88,51 23.11,50.24 23.11,47.8 U$1.P51
  Top 0.406: v37.72,75.51 v34.67,75.51
  Bottom 0.305: v34.67,75.51 32.51,73.36 30.35,73.36 29.84,72.85 29.84,62.31 28.57,61.04 27.43,61.04 26.8,60.4 26.8,53.92 v23.88,51
  Bottom 0.406: v52.64,76.02 38.29,76.02 v37.72,75.51
LCD_DB0
  Top 0.305: U$1.P94 20.32,28.48 20.32,25.86 25.91,20.27 25.91,16.71 25.27,16.08 22.48,16.08 21.48,14.95 U$12.2
LCD_DB1
  Top 0.254: 29.58,14.69 29.58,14.67 29.21,14.3 U$13.5
  Top 0.305: 29.58,14.69 29.59,15.57 29.58,23.96 26.67,26.87 26.67,27.27 U$1.P1
LCD_DB2
  Top 0.254: U$13.4 28.7,14.43 29.08,14.81 29.08,15.32
  Top 0.305: 29.08,15.32 29.08,21.54 23.84,26.78 U$1.P100
LCD_DB3
  Top 0.254: U$13.3 28.2,14.56 28.57,14.94 28.57,15.06
  Top 0.305: 28.57,15.06 28.58,21.4 22.86,27.13 22.86,27.49 U$1.P99
LCD_DB4
  Top 0.254: 28.07,15.06 27.69,14.68 27.69,13.76 U$13.2
  Top 0.305: U$1.P98 22.35,27.69 22.35,26.87 28.07,21.16 28.07,15.06
LCD_DB5
  Top 0.305: U$1.P4 28.19,27.87 28.19,27.64 31.11,24.71 31.11,19.25 31.75,18.62 34.54,18.62 35.04,18.12 U$14.5
LCD_DB6
  Top 0.305: U$1.P3 27.69,27.67 27.69,27.38 30.61,24.46 30.61,19 31.5,18.11 34.29,18.11 34.54,17.86 U$14.4
LCD_DB7
  Top 0.305: U$1.P2 27.18,27.47 27.18,27.13 30.1,24.21 30.1,18.75 31.24,17.6 33.78,17.6 34.04,17.34 U$14.3
LCD_E
  Top 0.305: U$1.P95 20.83,28.28 20.83,26.11 26.54,20.4 26.54,16.59 25.53,15.57 22.73,15.57 21.98,14.69 U$12.3
LCD_R/W
  Top 0.305: U$1.P96 21.34,28.08 21.34,26.37 27.05,20.65 27.05,16.21 25.91,15.06 22.99,15.06 22.48,14.43 U$12.4
LCD_RS
  Top 0.305: U$1.P97 21.84,27.88 21.84,26.62 27.56,20.9 27.56,15.82 26.29,14.55 23.24,14.55 22.98,14.17 U$12.5
MCLR  (via drill 0.6)
  Top 0.305: U$1.P11 30.45,30.56 v30.1,29.67 | v32.77,28.14 R16.2
  Bottom 0.305: v30.1,29.67 v32.77,28.14
  Bottom 0.406: SV1.6 17.91,16.59 17.91,19.51 20.7,22.3 22.99,24.33 29.08,24.33 v32.77,28.14
MIC_SIG  (via drill 0.6)
  Top 0.305: 35.69,35.26 35.66,35.26 U$1.P25
  Top 0.813: R7.1 v40.89,26.75 | v38.35,29.79 38.35,31.45 36.96,32.84 36.96,33.99 35.69,35.26
  Bottom 0.813: v40.89,26.75 39.88,26.75 38.35,28.27 v38.35,29.79
MOTOR_GND
  Bottom 2.184: 49.15,38.56 49.15,33.6 47.12,31.57 37.59,31.57 34.54,34.49 32,37.03 28.96,37.03 26.92,39.07 13.08,39.07 11.05,41.1 11.05,41.61 11.68,42.24 11.68,43 7.62,47.07 7.62,58.88 15.24,66.5
MOTOR_LA  (via drill 0.6)
  Top 0.305: v32.51,57.73 v29.72,57.73 | U$1.P70 15.87,41.61 15.87,43.12 v16.26,43.51
  Bottom 0.305: U$8.OUTA 39.88,56.34 38.5,57.72 v32.51,57.73 | v29.72,57.73 29.72,52.02 26.04,48.34 20.19,42.37 16.64,42.37 16.26,42.75 v16.26,43.51
MOTOR_LB  (via drill 0.6)
  Top 0.305: v32,58.75 28.96,58.75 v28.83,58.5 | U$1.P69 16.64,41.54 16.64,42.49 v17.27,43.13
  Bottom 0.305: U$8.OUTB 39.8,58.7 39.75,58.75 v32,58.75 | v17.27,43.13 17.65,42.88 19.81,42.88 25.53,48.72 28.83,52.02 v28.83,58.5
MOTOR_RA  (via drill 0.6)
  Top 0.305: v15.37,40.97 15.37,40.69 U$1.P72
  Bottom 0.305: v15.37,40.97 15.37,43.26 14.35,44.27 14.35,47.45 15.24,48.34 20.07,48.34 21.08,49.35 21.08,53.67 20.56,54.19 U$9.OUTA
MOTOR_RB  (via drill 0.6)
  Top 0.305: v14.33,40.82 14.33,40.61 14.86,40.08 15.27,40.08 U$1.P73
  Bottom 0.305: U$9.OUTB 13,52.19 10.03,49.23 10.03,47.45 14.78,42.7 14.78,41.53 14.33,41.07 v14.33,40.82
N$1
  Top 0.406: R10.1 5.71,24.69 IC1.1
N$2
  Top 0.406: IC1.5 6.45,22.02 7.37,22.94 7.37,24.21 9.78,26.62 R11.1
N$3
  Top 1.016: 5V_REG.3 35.14,58.08 34.92,57.86
  Top 1.27: D2.C 34.92,57.86 34.92,58.22 C1.+
N$4
  Top 0.813: 3V3_REG.3 14.07,55.09 D1.C 12.98,52.42 12.98,47.83 C2.+
N$5
  Top 0.406: IC1.11 7.25,18.12 7.25,21.3 8.66,22.71 8.66,24.23 10.03,25.6 11.68,25.6 12.06,25.98 12.04,25.98 12.04,26.58 R12.1
N$6
  Top 0.406: IC1.2 6.5,23.97 6.73,24.21 6.73,25.35 7.75,26.37 R13.1
N$7
  Top 0.406: IC1.16 11.16,16.82 9.78,15.44 9.78,12.14 9.4,11.76 6.86,11.76 6.1,11 U$2.D-
N$8
  Top 0.406: IC1.15 11.52,16.17 10.41,15.06 10.41,11.76 9.78,11.13 7.24,11.13 6.76,10.64 U$2.D+
N$9
  Top 0.406: IC1.17 13.34,17.47 14.35,17.48 14.35,16.63 C5.1
N$10
  Top 0.406: C7.1 14.22,19.42 IC1.20 10.07,19.42 8.64,17.98 8.64,16.53 4.81,12.71 | U$2.VCC 5.49,12.12 5.02,12.59 4.81,12.71 | 4.81,12.71 4.7,12.78 C6.+
N$11
  Top 0.406: U$10.CCP 40.78,39.97 40.13,39.32 40.13,38.12 C22.2
N$12  (via drill 0.6)
  Top 0.813: U$6.P$2 12.5,12.07 v11.68,11.25
  Bottom 0.813: v11.68,11.25 14.22,11.13 17.27,7.32 LCD.3
N$13
  Top 0.406: R1.1 52.58,11.63 52.45,11.51 52.45,6.66 52.96,6.15 53.59,6.11 C12.2
N$14
  Top 0.254: U$3.P$8 46.69,15.95 46.99,15.52 49.63,15.52 50.01,15.9 C8.1
N$15
  Top 0.254: U$3.P$12 50.33,17.98 C8.2
N$16
  Top 0.254: U$3.P$10 48.07,16.97 C9.1
N$17
  Top 0.305: R4.1 54.92,8.65 55.56,8.02 C12.1
  Top 0.406: M1.2 56.96,3.32 55.56,4.71 C12.1
  Top 0.813: C12.1 55.56,5.73
N$19
  Top 0.254: U$3.P$1 43.56,19.13 42.09,19.13 41.78,19.43 R8.1
N$20
  Top 0.254: U$3.P$16 44.2,19.5 R9.1
N$21
  Top 0.254: U$4.P$3 52.38,20.08 52.32,20.02
  Top 0.406: R1.2 52.06,14.62 52.96,15.82 52.96,19.38 52.32,20.02 51.56,20.02 51.18,19.63 48.58,19.63 R2.1
  Top 0.813: C13.1 R2.1
N$22
  Top 0.406: U$4.P$4 52.38,23.89 53.21,24.71 53.21,29.79 52.91,30.1 52.91,30.06 R6.2 C11.1 53.26,32.46 53.26,32.89 53.85,33.48 53.85,34.31 R5.1
N$24
  Top 0.254: U$4.P$1 49.16,20.95 R2.2
  Top 0.813: R2.2 C13.2 46.61,25.84 R7.2
N$26
  Top 0.254: U1.P$2 34.29,73.93
  Top 0.305: 34.29,73.93 35.05,73.16
  Top 0.406: 35.05,73.16 R15.1
N$27
  Top 0.406: U1.P$6 29.02,71.07 29.66,70.43 R14.1
N$35
  Top 0.254: LCD.4 18.67,1.6 20.45,1.6 20.95,2.11 20.95,3.51 21.72,4.27 22.86,4.27 23.62,5.03 23.62,8.59 22.99,9.22 U$12.10
N$36
  Top 0.254: LCD.5 20.45,5.54 21.72,6.81 22.23,6.81 22.48,7.06 U$12.11
N$37
  Top 0.254: LCD.6 19.56,3 18.54,4.01 18.54,6.3 19.05,6.81 20.83,6.81 21.97,7.95 21.97,10.24 21.98,10.24 U$12.12
N$38  (via drill 0.6)
  Top 0.254: v19.94,8.46 20.45,9.09 21.08,9.09 21.46,9.47 21.46,10.27 U$12.13
  Bottom 0.254: LCD.7 19.94,7.95 v19.94,8.46
N$39  (via drill 0.6)
  Top 0.254: v29.21,8.08 29.2,9.47 U$13.10
  Bottom 0.254: v29.21,8.08 23.88,8.08 23.62,7.82 23.62,3.38 23.11,2.87 22.48,2.87 LCD.8
N$40  (via drill 0.6)
  Top 0.254: v28.32,7.19 28.45,7.57 28.45,8.71 28.7,8.84 U$13.11
  Bottom 0.254: v28.32,7.19 24.77,7.19 24.38,6.81 24.38,6.05 LCD.9
N$41
  Top 0.254: LCD.10 25.4,3 26.16,3.76 26.16,8.2 26.8,8.84 27.69,8.84 28.19,9.35 U$13.12
N$42  (via drill 0.6)
  Top 0.254: v26.92,9.6 26.92,9.98 27.18,10.24 27.65,10.24 U$13.13
  Bottom 0.254: LCD.11 27.43,6.3 28.45,6.3 30.1,7.95 30.1,9.09 29.84,9.35 27.18,9.35 v26.92,9.6
N$43
  Top 0.254: 35.05,12.34 U$14.10 35.04,11.88 34.42,11.25 34.42,2.36 33.78,1.73 27.81,1.73 27.3,2.24 27.3,2.87 LCD.12
N$44
  Top 0.254: LCD.13 33.02,5.54 33.78,6.3 33.78,11.25 34.54,12.01 U$14.11
N$45
  Top 0.254: LCD.14 28.7,4.27 28.7,6.17 30.61,8.08 32.26,8.08 33.15,8.97 33.15,11.25 34.04,12.15 U$14.12
N$46  (via drill 0.6)
  Top 0.305: U$10.OUT1_1 50.76,41.57 51.18,41.99
  other vias: 44.58,51.45 45.97,51.45 44.58,50.18 45.97,50.18 45.97,52.72 43.18,50.18 44.58,52.72
  pour Top (isolate 0.406): 49.99,41.35 49.99,44.09 51.94,44.09 52.3,44.4 52.3,49.17 51.92,49.61 42.62,49.61 42.52,49.71 42.52,50.83 42.72,51.03 43.41,51.03 43.84,51.46 43.84,52.98 44.3,53.44 52.49,53.44 53.24,52.69 53.24,42.41 52.13,41.35
  pour Bottom (no thermals): 46.35,49.71 40.01,49.71 40.01,50.7 42.21,50.7 42.62,50.98 43.38,51.03 43.84,51.44 43.84,52.96 44.22,53.44 46.35,53.44
N$47  (via drill 0.6)
  Top 0.406: U$11.CCP 19.55,68.64 20.07,69.16 22.1,69.16 v22.73,69.8
  Top 0.813: C25.2 26.29,74.37 v25.78,74.88
  Bottom 0.813: v25.78,74.88 22.73,71.83 v22.73,69.8
N$48
  Top 0.305: U$1.P15 32.09,31.74 C29.1
N$49
  Top 0.813: C30.1 38.61,24.4 R17.1 34.42,23.38 R16.1
N$70  (via drill 0.6)
  other vias: 36.32,52.91 36.32,50.37 37.59,52.91 37.59,51.64 38.86,52.91 36.32,51.64 38.86,51.64
  pour Top (isolate 0.406): 41.59,41.29 41.59,44.08 40.77,44.08 40.77,50.18 40.39,51 39.94,51 39.69,51.26 39.37,51.7 39.37,52.97 38.73,53.61 35.56,53.61 35.69,49.92 36.32,49.03 39.88,48.97 39.88,41.48
  pour Bottom (no thermals): 40.96,51.7 39.37,51.7 39.05,51.38 37.78,51.38 37.47,51.07 37.47,50.11 37.15,49.8 36.51,49.8 36.2,50.11 36.2,50.75 35.56,51.38 35.56,53.29 35.88,53.61 38.73,53.61 39.69,52.65 40.96,52.65
N$71  (via drill 0.6)
  other vias: 21.21,58.62 22.48,57.35 23.11,59.89 22.48,58.62 21.21,57.35
  pour Top (isolate 0.406): 18.41,69.16 18.41,64.27 21.91,64.27 22.42,63.39 22.54,59.32 22.23,59 20.95,59 20.64,58.69 20.64,57.42 21.27,56.78 24.45,56.78 24.45,67.07 23.81,68.85 23.18,69.16
  pour Bottom (no thermals): 19.05,58.69 20.64,58.69 20.95,59 22.23,59 22.54,59.32 22.54,60.27 22.86,60.59 23.5,60.59 23.81,60.27 23.81,59.64 23.3,58.88 23.3,56.97 22.86,56.78 21.27,56.78 20.32,57.73 19.05,57.73
N$72  (via drill 0.6)
  other vias: 17.08,60.21 15.81,60.21 14.54,60.21 14.54,58.94 15.81,58.94 14.54,57.67 15.81,57.67
  pour Top (isolate 0.406): 10.46,67.13 10.85,67.18 10.79,66.42 11.07,65.61 10.95,60.91 17.7,60.78 17.81,60.68 17.81,59.56 17.6,59.36 16.92,59.36 16.48,58.93 16.48,57.4 16.03,56.95 8.98,56.95 7.72,57.7 7.59,67.09 8.32,67.13
  pour Bottom (no thermals): 13.97,60.68 20.32,60.68 20.32,59.69 18.11,59.69 17.7,59.41 16.94,59.36 16.48,58.95 16.48,57.43 16.1,56.95 13.97,56.95
PGC  (via drill 0.6)
  Top 0.305: U$1.P65 21.84,39.17 v21.84,34.87
  Bottom 0.406: SV1.2 3.81,26.75 6.1,29.03 12.06,29.03 12.7,29.67 12.7,30.18 16,33.48 20.45,33.48 v21.84,34.87
PGD  (via drill 0.6)
  Top 0.305: v23.37,43.13 22.83,43.13 U$1.P58
  Top 0.406: v23.88,34.24 v23.88,41.35
  Bottom 0.406: SV1.3 2.79,24.21 6.73,28.14 12.19,28.14 13.46,29.41 13.46,29.92 16.26,32.72 22.48,32.72 23.88,34.11 v23.88,34.24 | v23.88,41.35 23.88,42.62 v23.37,43.13
PIXY_RX  (via drill 0.6)
  Top 0.305: v32.51,64.72 32.26,64.47 v28.45,64.47 | v22,47.5 22.1,47.4 U$1.P53
  Bottom 0.305: U$15.1 41.53,68.02 36.83,68.02 36.2,67.39 36.2,66.5 34.42,64.72 v32.51,64.72 | v28.45,64.47 26.42,64.47 25.53,63.58 25.53,56.08 22.48,53.04 22.48,47.98 v22,47.5
PIXY_TX  (via drill 0.6)
  Top 0.305: U$15.4 39.24,65.74 v28.45,65.74 | U$1.P57 20.08,46.58 v20.07,47.45
  Bottom 0.305: v28.45,65.74 26.16,65.74 24.89,64.47 24.89,56.46 21.74,53.31 21.74,48.59 20.6,47.45 v20.07,47.45
R_WHISKER  (via drill 0.5, 3.2)
  Top 0.305: v23.19,51.89 24.89,51.89 26.18,50.61 U$1.P50 | v22.73,75.39 22.86,75.51 22.86,77.29 22.61,77.55 20.19,77.55 18.92,76.28 7.49,76.28 v7.37,76.15
  Bottom 0.305: v23.19,51.89 26.16,54.86 26.16,60.66 27.18,61.67 28.32,61.67 29.21,62.56 29.21,66.12 28.83,66.62 24.51,66.62 20.83,70.31 20.83,73.23 22.73,75.13 v22.73,75.39
RST1  (via drill 0.6)
  Top 0.254: IR_CAM.2 50.67,69.29 47.5,69.29 47.12,68.91 47.12,65.48 46.1,64.47 46.1,62.94 v46.61,62.43 | v48.01,54.56 47.75,54.43 35.69,54.43 34.92,53.67 34.92,49.99 33.4,48.46 30.86,48.46 30.48,48.84 29.72,48.84 29.34,48.46 29.34,48.11 U$1.P47
  Bottom 0.254: v46.61,62.43 46.61,57.61 48.01,56.21 v48.01,54.56
RST2  (via drill 0.6)
  Top 0.254: IR_CAM.1 50.04,70.94 46.99,70.94 45.09,69.04 45.09,66.75 45.59,66.24 45.59,61.8 v45.72,61.67 | v47.24,55.32 35.31,55.32 34.29,54.31 34.29,50.37 33.02,49.1 31.11,49.1 30.86,49.35 29.46,49.35 28.83,48.72 28.83,48.3 U$1.P48
  Bottom 0.254: v45.72,61.67 45.72,57.73 47.24,56.21 v47.24,55.32
SERVO_SIGNAL
  Top 0.305: U$1.P26 36.96,40.88 SERVO.3
SW1  (via drill 0.6)
  Top 0.305: v25.02,34.87 25.78,34.11 28.32,34.11 29.46,32.97 29.72,32.71 U$1.P13
  Bottom 0.305: v25.02,34.87 25.78,34.11 27.69,34.11 28.19,33.6 28.96,33.6 30.35,32.21 31.5,32.21 42.8,20.9 47.12,20.9 48.01,20.02 48.01,14.94 48.64,14.3 50.04,14.3 51.18,13.16 SW1.1
SW2  (via drill 0.5)
  Top 0.305: v27.43,33.22 28.57,33.1 29.21,32.51 U$1.P12
  Bottom 0.305: SW1.2 48.13,11 48.13,13.67 47.37,14.68 47.37,19.76 46.74,20.4 42.55,20.4 31.24,31.7 30.1,31.7 28.7,33.1 27.56,33.1 v27.43,33.22
SW3  (via drill 0.5)
  Top 0.305: v28.32,32.33 28.32,31.98 U$1.P10
  Bottom 0.305: v28.32,32.33 28.32,31.98 U$1.P10 30.11,30.94 30.35,31.19 30.99,31.19 40.77,21.41 40.77,17.73 41.78,16.71 42.67,16.71 45.59,13.79 45.59,11 SW1.3
SW4  (via drill 0.6)
  Top 0.305: v24.89,33.48 26.11,33.46 U$1.P9 | v28.7,23.44 v26.92,25.2
  Bottom 0.305: v26.92,25.2 25.02,27.13 25.02,29.03 26.29,30.3 26.29,32.21 v24.89,33.48 | SW1.4 44.45,11.38 44.45,14.05 42.42,16.08 27.43,16.08 26.54,16.97 26.54,21.16 v28.7,23.44
SW5  (via drill 0.6)
  Top 0.305: v22.45,22.66 v21.08,23.95 | U$1.P8 26.29,32.6 26.16,32.72 v24.13,32.72
  Bottom 0.254: 43.18,14.43 43.56,14.05 43.56,12.78 41.27,10.49 SW1.5
  Bottom 0.305: 43.18,14.43 42.16,15.44 27.3,15.44 25.91,16.84 25.91,20.14 23.75,22.3 22.86,22.3 v22.45,22.66 | v21.08,23.95 21.08,25.73 25.78,30.56 25.78,31.7 24.77,32.59 24.64,32.72 v24.13,32.72
SW6  (via drill 0.6)
  Top 0.305: v21.59,21.92 v20.32,23.19 | U$1.P7 26.21,31.97 24.26,31.95 v23.24,31.95
  Bottom 0.254: 42.8,13.79 42.8,12.78 42.16,12.14 40.39,12.14 38.73,10.49 SW1.6
  Bottom 0.305: 42.8,13.79 42.55,14.05 41.91,14.81 20.57,14.81 19.56,15.95 19.56,20.27 21.46,22.05 v21.59,21.92 | v20.32,23.19 20.32,25.86 25.15,30.68 25.15,31.39 24.59,31.95 v23.24,31.95
SW7  (via drill 0.6)
  Top 0.305: v18.8,19 18.8,21.54 v19.56,22.3 | v24.13,31.06 24.28,31.17 26.29,31.19 U$1.P6 | v42.04,13.03 42.29,12.78 42.29,9.09 41.91,8.71 36.58,8.71 36.2,9.09 36.2,10.24 SW1.7
  Bottom 0.305: v42.04,13.03 42.04,13.79 41.66,14.17 20.32,14.17 18.8,16.08 v18.8,19 | v19.56,22.3 19.56,25.86 24.13,30.43 v24.13,31.06
USB_CTS  (via drill 0.6)
  Top 0.305: v20.07,34.37 20.07,33.89 U$1.P86
  Top 0.406: R12.2 v11.81,30.07
  Bottom 0.406: v20.07,34.37 19.94,34.24 15.75,34.24 11.81,30.3 v11.81,30.07
USB_DTR  (via drill 0.6)
  Top 0.305: v18.03,35.89 18.54,35.38 18.54,34.48 U$1.P83
  Top 0.406: R13.2 v7.75,30.07
  Bottom 0.406: v18.03,35.89 17.91,35.64 15.11,35.64 10.92,31.45 8.38,31.45 7.75,30.81 v7.75,30.07
USB_RXD  (via drill 0.6)
  Top 0.305: v20.83,35.26 19.81,35.26 19.18,34.75 19.18,34.41 U$1.P84
  Top 0.406: R11.2 v9.78,30.07
  Bottom 0.406: v20.83,35.26 19.81,35.26 19.51,35 15.49,35 11.18,30.68 10.29,30.68 9.78,30.18 v9.78,30.07
USB_TXD  (via drill 0.6)
  Top 0.305: U$1.P82 16.83,33.48 16.26,32.97
  Top 0.406: 16.26,32.97 12.83,32.97 v11.94,33.86 | v5.71,30.07 R10.2
  Bottom 0.406: v11.94,33.86 10.29,32.21 6.99,32.21 5.71,30.94 v5.71,30.07
V+  (via drill 0.6)
  Top 0.406: 45.72,35.76 45.85,35.89 | 45.85,35.89 46.52,36.56 U$10.VPWR1 46.52,35.55 v45.72,34.75 | U$10.VPWR 44.92,36.82 45.85,35.89 | v45.09,35.76 45.21,35.64 45.21,34.75 45.09,34.62 v45.09,33.73 45.72,34.37 v45.72,34.75 | v46.35,33.73 46.35,34.11 v45.72,34.75 | v46.99,34.75 v45.72,34.75 | v46.35,35.76 46.35,35.38 v45.72,34.75 | v30.99,51.26 v32.13,51.26 | v31.5,52.27 31.5,51.89 v32.13,51.26 | v32.77,52.27 32.77,51.89 v32.13,51.26 | v33.27,51.26 v32.13,51.26 | v32.77,50.24 32.77,50.62 v32.13,51.26 | v31.5,50.24 31.5,50.62 v32.13,51.26 | U$10.VPWR_2 40.31,40.77 39.75,40.21 | 51.94,40.59 51.64,40.77 | C22.1 37.91,38.37 v39.12,39.57 | C26.1 26.74,68.14 26.09,68.79 | C25.1 25.97,71.26 24.77,70.05 | C27.+ 21.05,76.15 | U$11.VPWR_2 20.02,67.84 20.19,68.02
  Top 0.61: 51.64,40.77 U$10.VPWR2
  Top 0.813: 15.24,50.24 14.98,50.5 D1.A | 39.75,40.21 v39.12,39.57 | 25.04,70.15 24.94,70.05 24.77,70.05 22.73,68.02 20.19,68.02
  Top 1.016: 15.24,50.24 16.45,49.04 16.45,48.53
  Top 1.27: 52.45,39.83 52.45,40.59 51.94,40.59 | v45.72,34.75 44.07,34.87 C24.+ 39.84,35.92 C23.1 | D2.A 29.34,53.8
  Top 1.778: 52.32,39.83 52.45,39.83 | 21.05,76.15 21.08,74.24
  Top 1.93: BATT_CON.1 13.84,43.89 | 25.91,54.31 25.91,68.53
  Top 2.54: 13.84,43.89 16,46.07 16,48.08 16.45,48.53 22.5,53.75 25.4,53.8 25.65,54.05 | 45.72,35.76 v45.72,34.75 48.77,34.75 50.67,36.65 51.82,36.78 52.32,37.41 52.32,39.83 | 25.91,68.53 26.09,68.79 25.04,70.15 24.13,71.32 21.08,74.24 19.68,74.24 | 25.91,54.31 25.65,54.05 | 25.65,54.05 25.65,53.8 29.34,53.8 29.59,53.8 v32.13,51.26
  Bottom 0.813: v39.12,39.57 37.08,37.54
  Bottom 2.54: v32.13,51.26 32.13,43.26 33.78,41.61 33.91,40.72 37.08,37.54 39.88,34.75 v44.45,34.75 v45.72,34.75
  pour Top: 6.6,67.77 6.6,77.42 19.68,77.42 19.68,69.55 10.92,69.55 10.92,67.77

## Text on the board
Bottom: Yes / This is gold
tNames: Stop looking at our under side | PIC = Brainz
bValues: Congrats / You have 20/20 vision | Eyeballs | Mount Here | Ladder 42 | Mount a spinny / thing here | The "$50" bot | If you can read this / we have problems | ! | ! | USB | Broderick Carlin / Tyler Holmes
bStop: Yes / This is gold